# Altium schematic sheet Power.SchDoc
size A4; SheetNumber: 2; SheetTotal: 5
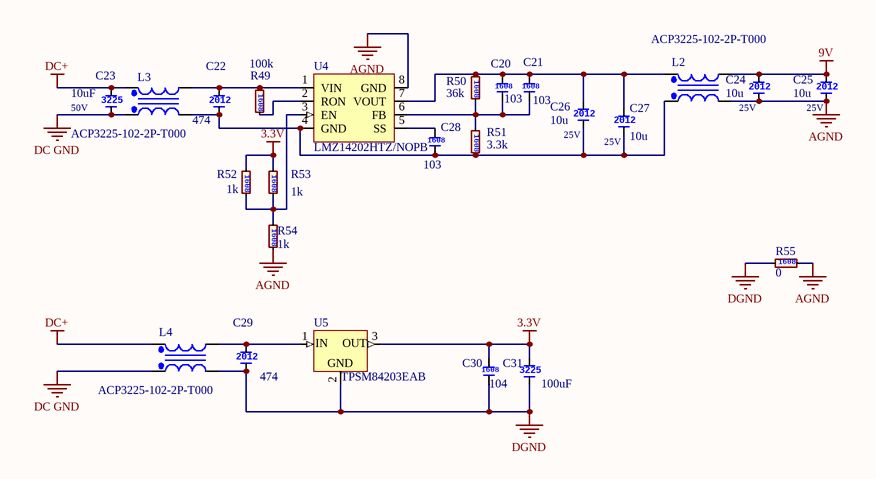
[diagram p0: Power.SchDoc]

## Parts
C20  Tag: 103  [C1608]  (hidden comment: GCD188R71H103KA01D)
C21  Tag: 103  [C1608]  (hidden comment: GCD188R71H103KA01D)
C22  Tag: 474  [C2012]  (hidden comment: GRM21BR71H474MA88)
C23  Tag: 10uF  Voltage: 50V  [C3225]  (hidden comment: UMK325C7106MM-T)
C24  Tag: 10u  Voltage: 25V  [C2012]  (hidden comment: TMK212BBJ106MG-T)
C25  Tag: 10u  Voltage: 25V  [C2012]  (hidden comment: TMK212BBJ106MG-T)
C26  Tag: 10u  Voltage: 25V  [C2012]  (hidden comment: TMK212BBJ106MG-T)
C27  Tag: 10u  Voltage: 25V  [C2012]  (hidden comment: TMK212BBJ106MG-T)
C28  Tag: 103  [C1608]  (hidden comment: GCD188R71H103KA01D)
C29  Tag: 474  [C2012]  (hidden comment: GRM21BR71H474MA88)
C30  Tag: 104  [C1608]  (hidden comment: CGA3E2X7R1H104K080AA)
C31  Tag: 100uF  [C3225]  (hidden comment: EMK325ABJ107MM-T)
L2  ACP3225-102-2P-T000  [ACM3225]
L3  ACP3225-102-2P-T000  [ACM3225]
L4  ACP3225-102-2P-T000  [ACM3225]
R49  Tag: 100k  [R1608]  (hidden comment: ERJ-PA3F1003V)
R50  Tag: 36k  [R1608]  (hidden comment: ERJ-PA3F3602V)
R51  Tag: 3.3k  [R1608]  (hidden comment: ERJ-PA3F3301V)
R52  Tag: 1k  [R1608]  (hidden comment: ERJ-PA3F1000V)
R53  Tag: 1k  [R1608]  (hidden comment: ERJ-PA3F1000V)
R54  Tag: 1k  [R1608]  (hidden comment: ERJ-PA3F1000V)
R55  Tag: 0  [R1608]  (hidden comment: ERJ-S030R00V)
U4  LMZ14202HTZ/NOPB  [TO-PMOD-7]
U5  TPSM84203EAB  [TO220-3]

## Nets
3.3V: C30.2 C31.2 R52.1 R53.1 U5.3(OUT)
9V: C24.2 C25.2 L2.4(Pri+)
AGND: C24.1 C25.1 L2.3(Pri-) R54.2 R55.2 U4.8(GND)
DC GND: C23.1 L3.2(Sec-) L4.2(Sec-)
DC+: C23.2 L3.1(Sec+) L4.1(Sec+)
DGND: C29.1 C30.1 C31.1 L4.3(Pri-) R55.1 U5.2(GND)
NetC20_1: C20.1 C21.1 R50.2 R51.1 U4.6(FB)
NetC20_2: C20.2 C21.2 C26.2 C27.2 L2.1(Sec+) R50.1 U4.7(VOUT)
NetC22_1: C22.1 C26.1 C27.1 C28.1 L2.2(Sec-) L3.3(Pri-) R51.2 U4.4(GND)
NetC22_2: C22.2 L3.4(Pri+) R49.1 U4.1(VIN)
NetC28_2: C28.2 U4.5(SS)
NetC29_2: C29.2 L4.4(Pri+) U5.1(IN)
NetR49_2: R49.2 U4.2(RON)
NetR52_2: R52.2 R53.2 R54.1 U4.3(EN)

## Notes on the sheet
- Project Title:
- Project No:
- Size:
- Date:
- A4
- Rev:
- Page Title:
- Sheet:
- of
- (in symbol C1608) 1608
- (in symbol C2012) 2012
- (in symbol C3225) 3225
- (in symbol TF1608) 1608

## Library data of the parts
C20 C21 C28 = C1608: セラコン1608サイズ; Vendor: Murata; Voltage: 50V
C22 C29 = C2012: セラコン2012サイズ; Vendor: Murata; Voltage: 50V
C23 = C3225: セラコン3225サイズ; Vendor: *
C24-C27 = C2012: セラコン2012サイズ; Vendor: Murata
C30 = C1608: セラコン1608サイズ; Vendor: TDK; Voltage: 50V
C31 = C3225: セラコン3225サイズ; Vendor: TaiyoYuden; Voltage: 50V
L2-L4 = ACM3225: コモンモード,1A,4ピン; Vendor: TDK
R49-R55 = TF1608: 厚膜チップ抵抗1608サイズ; Vendor: Panasonic
U4 = LMZ14202HTZ/NOPB: DC DC CONVERTER 5-30V; Vendor: Texas Instruments
U5 = TPSM84203EAB: DC DC CONVERTER 3.3V; Vendor: Texas Instruments